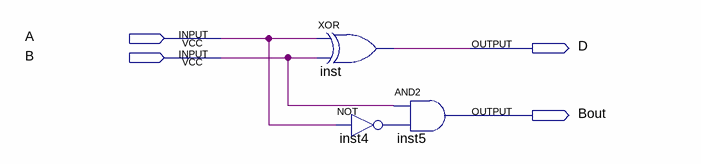
[diagram p0: schematic sheet]
// Quartus schematic HalfSubstractor.bdf as structural Verilog: 3 symbols, 4 pins
module HalfSubstractor (
  input  A,
  input  B,
  output D,
  output Bout
);

  wire inst4_out;

  xor inst (D, A, B);
  not inst4 (inst4_out, A);
  and inst5 (Bout, B, inst4_out);
endmodule
